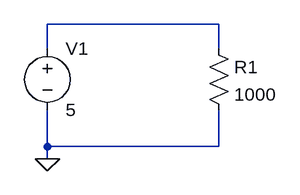
[diagram p0: schematic simple_dc_resistor.asc]
simple_dc_resistor.asc, the LTspice schematic file:
Version 4
SHEET 1 880 680
WIRE 320 96 96 96
WIRE 96 128 96 96
WIRE 320 128 320 96
WIRE 96 256 96 208
WIRE 320 256 320 208
WIRE 320 256 96 256
WIRE 96 272 96 256
FLAG 96 272 0
SYMBOL voltage 96 112 R0
WINDOW 123 0 0 Left 0
WINDOW 39 0 0 Left 0
SYMATTR InstName V1
SYMATTR Value 5
SYMBOL res 304 112 R0
SYMATTR InstName R1
SYMATTR Value 1000

The netlist it stands for:
* simple_dc_resistor.asc
V1 N001 0 5
R1 N001 0 1000
.backanno
.end